# Altium schematic sheet CheckingSystem.SchDoc: <?>
size 420 x 297 mm; ApprovedBy: <?>; CheckedBy: <?>; CompanyName: ISON IMPORT-EXPORT COMPANY LIMITED; DrawnBy: <?>; DocumentNumber: <?>; Revision: <?>; SheetNumber: <?>; SheetTotal: <?>; Size: A3; ISON_Model: <?>
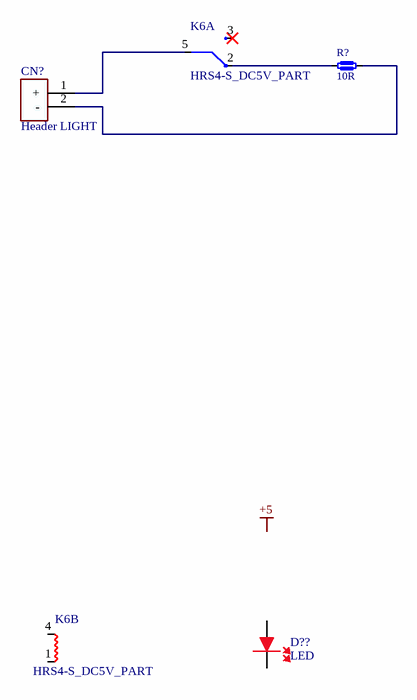
[diagram p0: CheckingSystem.SchDoc]

## Parts
CN?  Header LIGHT  [HEADER 2 PIN MOLEX POLE]
D??  LED  [0805 LED]
K6  HRS4-S_DC5V_PART  [HRS4SDC5V]  (parts A,B of 2)
R?  10R

## Nets
NetCN?_1: CN?.1(+) K6.5(COM)
NetCN?_2: CN?.2(-) R?.1
NetK6_2: K6.2(NC) R?.2

Not connected (* = marked no-connect by the designer): D?? 1(K) 2(A); K6 1(COIL_1) 3(NO)* 4(COIL_2)

## Notes on the sheet
- Labels drawn without touching a wire or pin: +5
- Modify 1:
- DWG No:
- Model:
- SHEET:
- Modify 2:
- ORIGINAL:
- Revision:
- Date:
- Draw By:
- Size:
- File:
- Approve By:
- TOTAL:
- Modify 3:

## Library data of the parts
CN? = CON Header LIGHT Pole: Connector 3.96MM 02 PIN WAFER STRAIGHTPIN (MALE)
D?? = LED RED (SMD): LED SMD  mcd,Red Color Red Diffused Lens
K6 = HRS4-S_DC5V_PART: Relay or Contactor; Manufacturer_Name: MULTICOMP; Manufacturer_Part_Number: HRS4-S DC5V; Datasheet Link: http://www.farnell.com/datasheets/1306711.pdf; Height: 16mm
R? = Dummy Load: 10 OHM , 40 W . Made by Parallel of 2 Resistor 20 OHM 20 W